# Altium schematic sheet fleischerTowR1.SchDoc
size A2
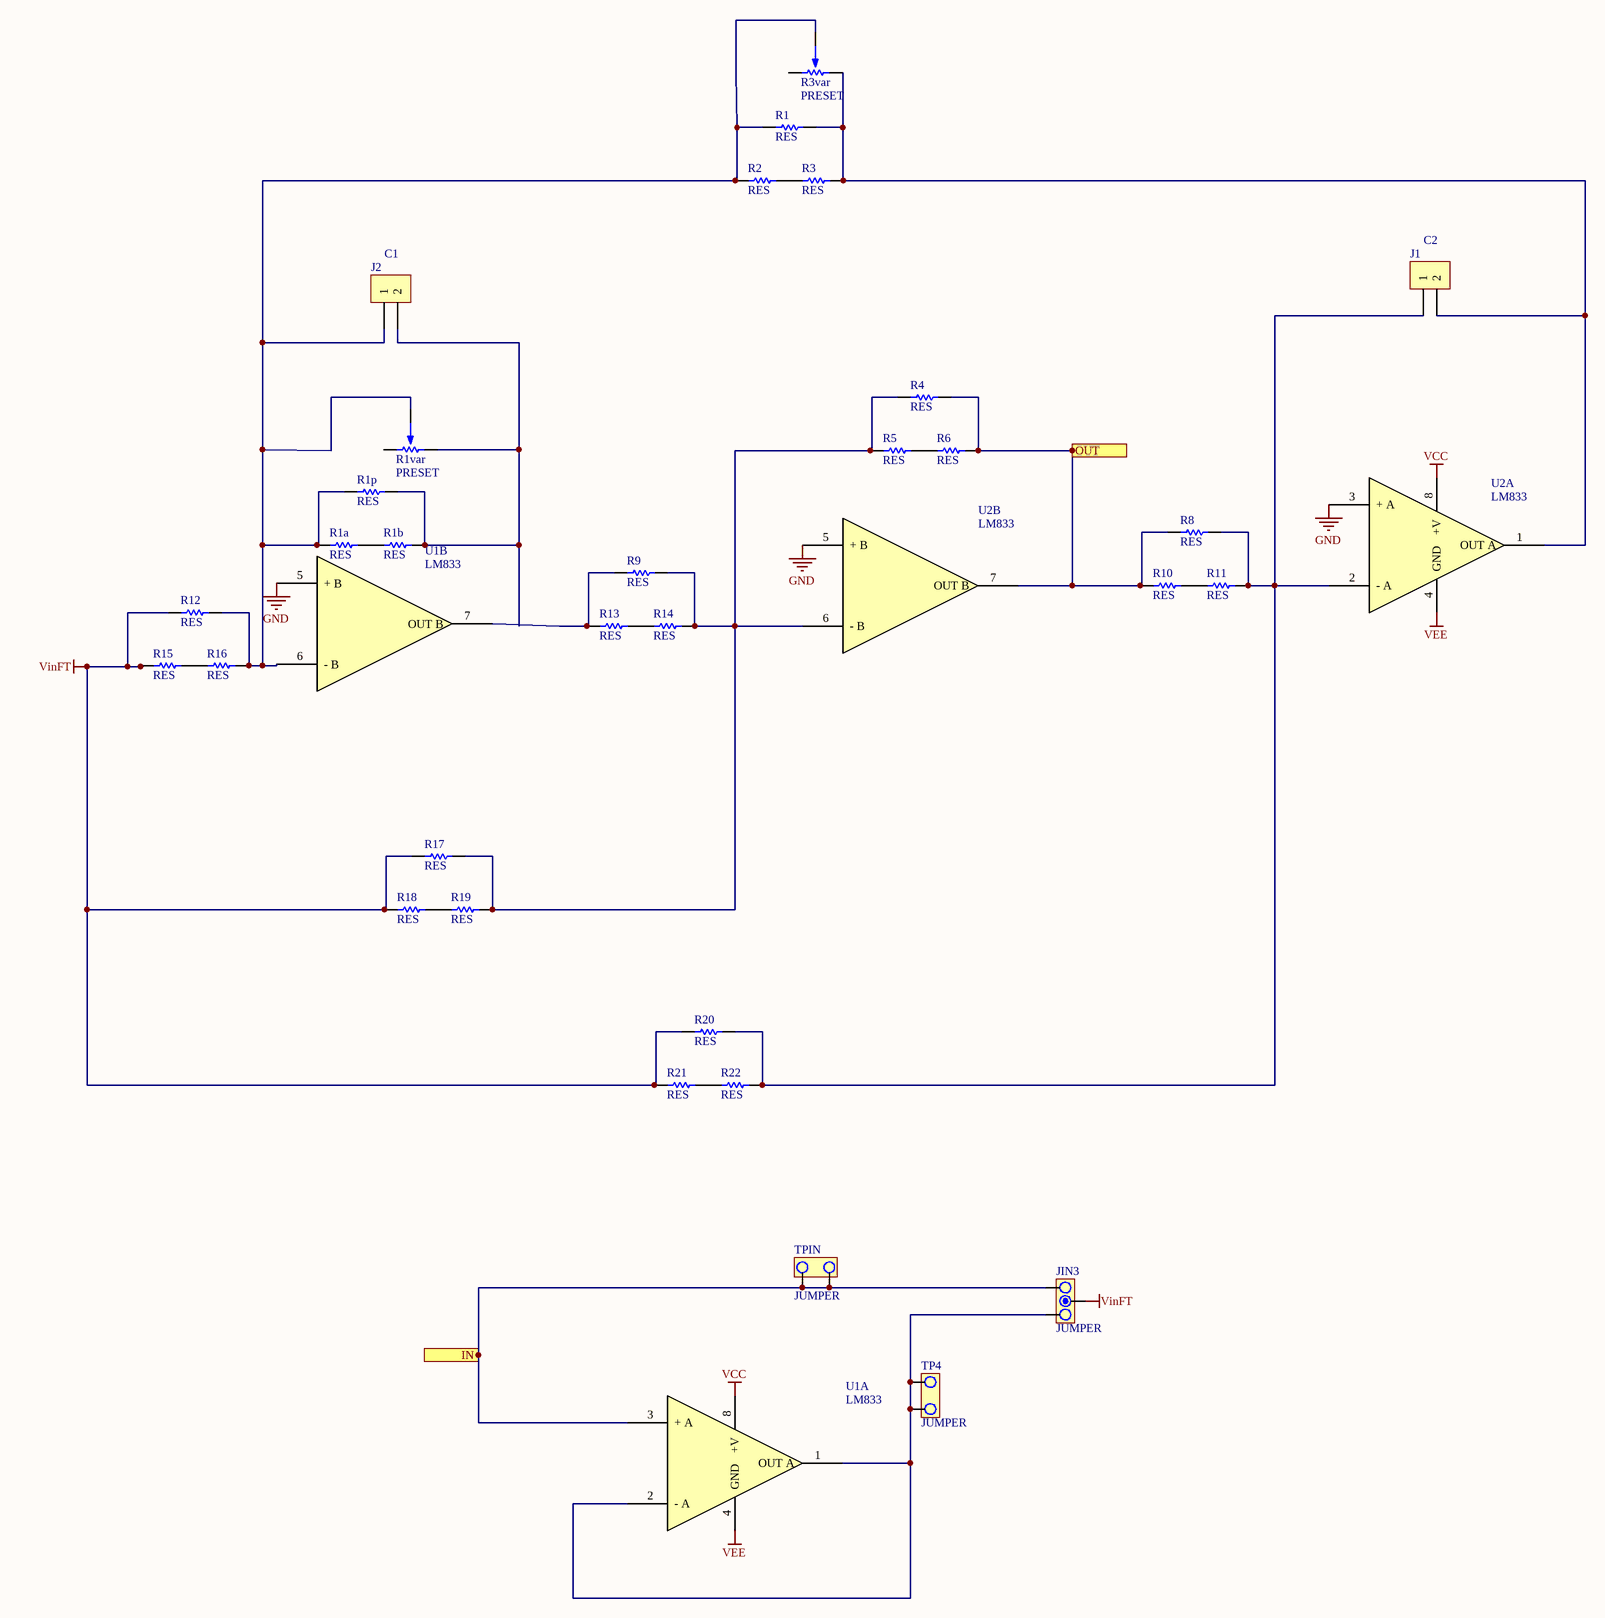
[diagram p0: fleischerTowR1.SchDoc]

## Parts
J1  C2  [SIP2]
J2  C1  [SIP2]
JIN3  JUMPER  [JUMPER3]
R1  RES  [0805]
R1a  RES  [0805]
R1b  RES  [0805]
R1p  RES  [0805]
R1var  PRESET  [PRESET V]
R2  RES  [0805]
R3  RES  [0805]
R3var  PRESET  [PRESET V]
R4  RES  [0805]
R5  RES  [0805]
R6  RES  [0805]
R8  RES  [0805]
R9  RES  [0805]
R10  RES  [0805]
R11  RES  [0805]
R12  RES  [0805]
R13  RES  [0805]
R14  RES  [0805]
R15  RES  [0805]
R16  RES  [0805]
R17  RES  [0805]
R18  RES  [0805]
R19  RES  [0805]
R20  RES  [0805]
R21  RES  [0805]
R22  RES  [0805]
TP4  JUMPER  [JUMPER2]
TPIN  JUMPER  [JUMPER2]
U1  LM833  [DIP8]  (parts A,B of 2)
U2  LM833  [DIP8]  (parts A,B of 2)

## Ports
IN, OUT

## Nets
GND: U1.5(+_B) U2.3(+_A) U2.5(+_B)
VCC: U1.8(+V) U2.8(+V)
VEE: U1.4(GND) U2.4(GND)
VinFT: JIN3.2 R12.1 R15.1 R17.1 R18.1 R20.1 R21.1
IN: JIN3.3 TPIN.1 TPIN.2 U1.3(+_A) ; port IN
OUT: R4.2 R6.2 R8.1 R10.1 U2.7(OUT_B) ; port OUT
NetJ1_1: J1.1 R8.2 R11.2 R20.2 R22.2 U2.2(-_A)
NetJ1_2: J1.2 R1.2 R3.2 R3var.3 U2.1(OUT_A)
NetJ2_1: J2.1 R1.1 R1a.1 R1p.1 R1var.2 R2.1 R3var.2 R12.2 R16.2 U1.6(-_B)
NetJ2_2: J2.2 R1b.2 R1p.2 R1var.3
NetJIN3_1: JIN3.1 TP4.1 TP4.2 U1.1(OUT_A) U1.2(-_A)
NetR1a_2: R1a.2 R1b.1
NetR2_2: R2.2 R3.1
NetR4_1: R4.1 R5.1 R9.2 R14.2 R17.2 R19.2 U2.6(-_B)
NetR5_2: R5.2 R6.1
NetR9_1: R9.1 R13.1 U1.7(OUT_B)
NetR10_2: R10.2 R11.1
NetR13_2: R13.2 R14.1
NetR15_2: R15.2 R16.1
NetR18_2: R18.2 R19.1
NetR21_2: R21.2 R22.1

Not connected (* = marked no-connect by the designer): R1var 1; R3var 1

## Notes on the sheet
- Title
- Size:
- Date:
- File:
- A2
- Number:
- Time:
- Revision:
- Sheet
- of

## Library data of the parts
J1 J2 = CON2
JIN3 = JUMPER3
U1 U2 = LM833: Dual Audio Operational Amplifier